# EAGLE board A13-SOM-LTE_Rev_B1 (EAGLE 4.16), part 1 of 2
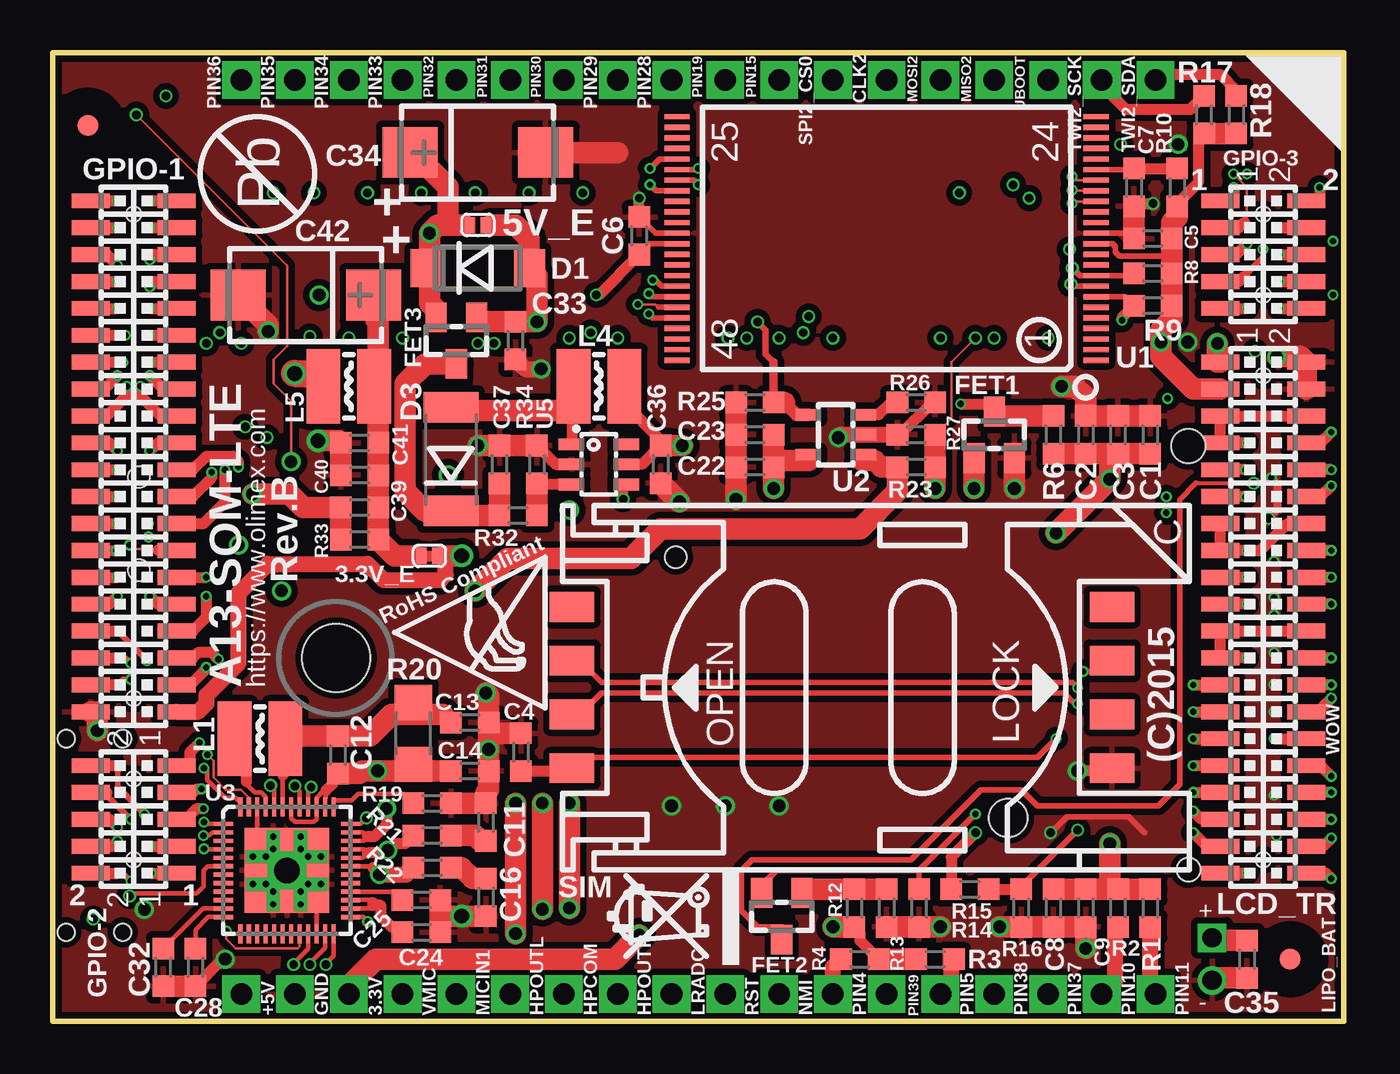
[diagram p2: board, top side]
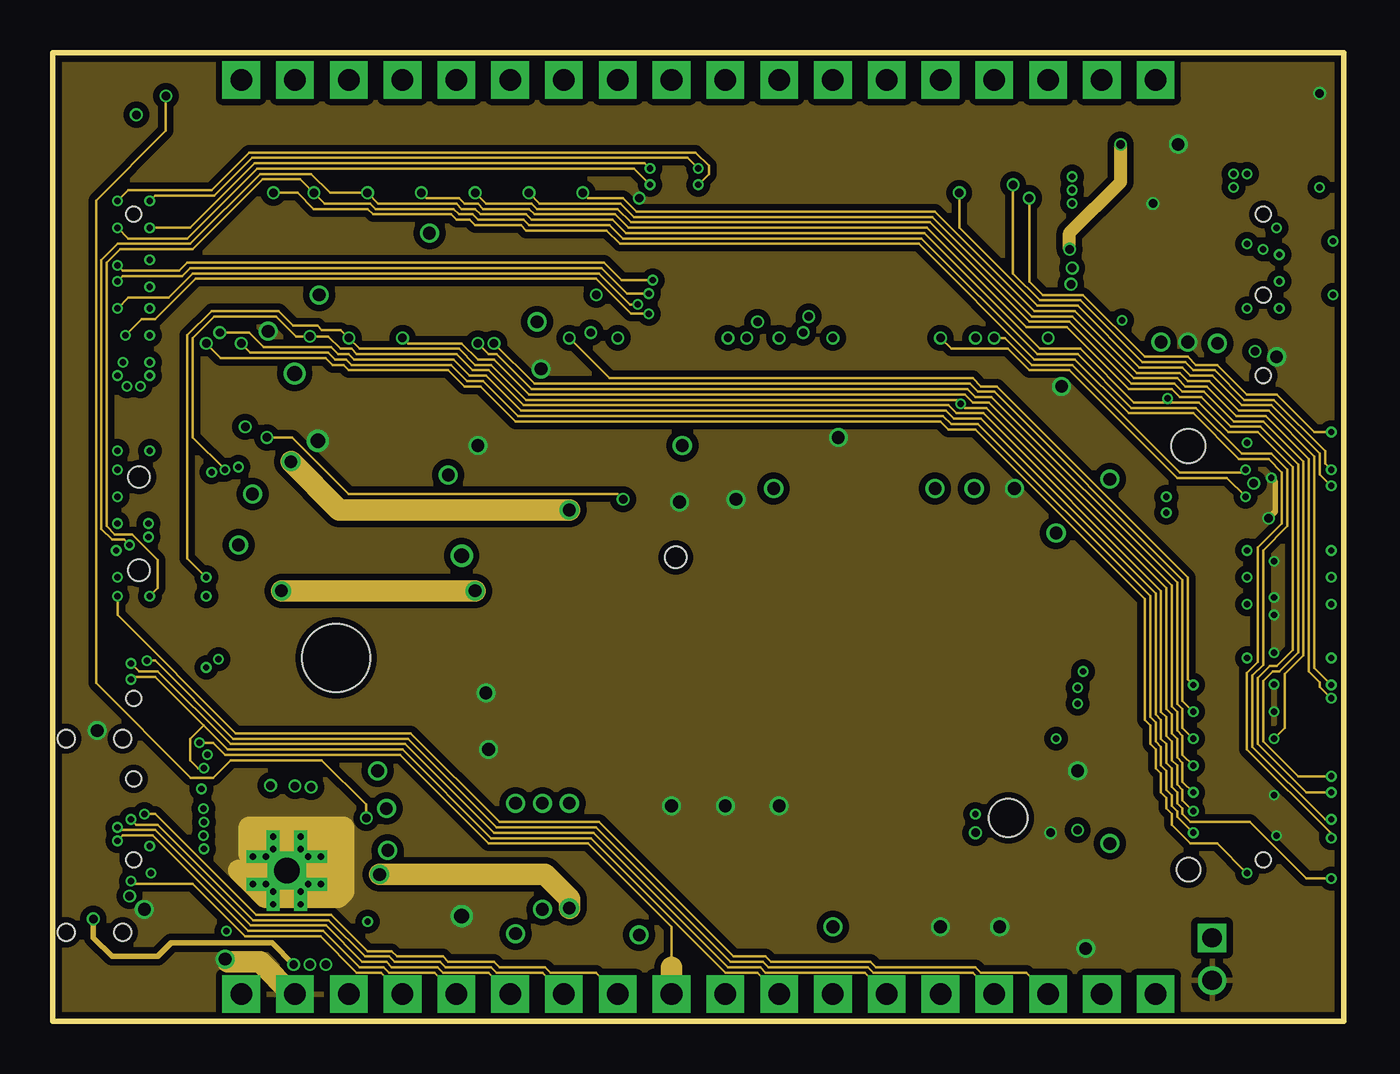
[diagram p3: board, inner layer Route2]
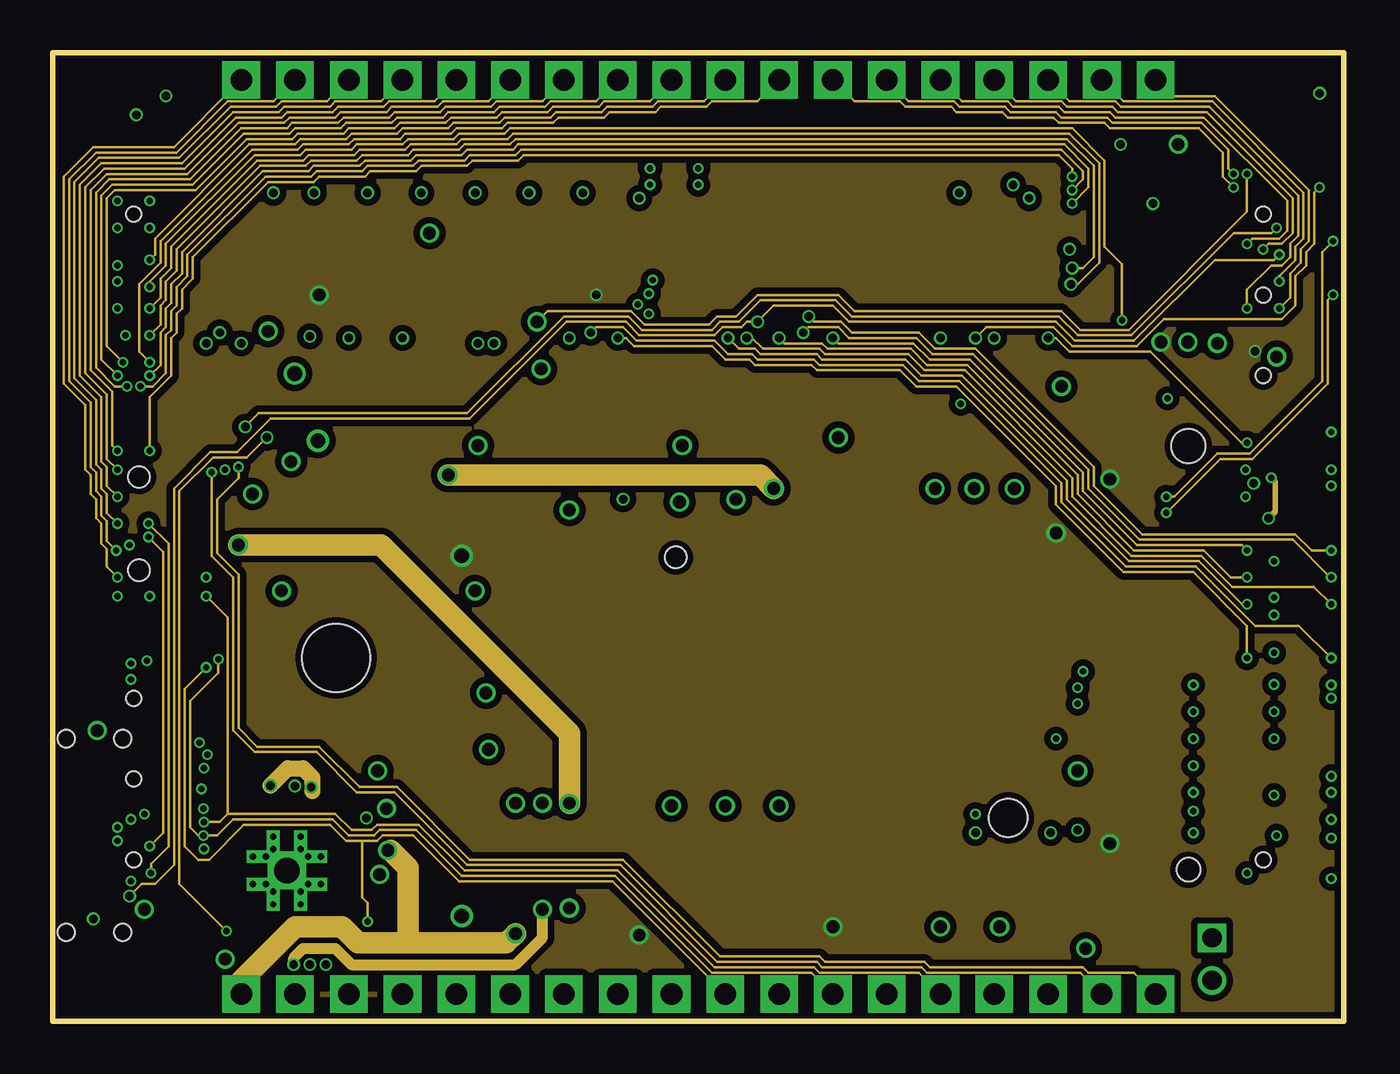
[diagram p4: board, inner layer Route15]
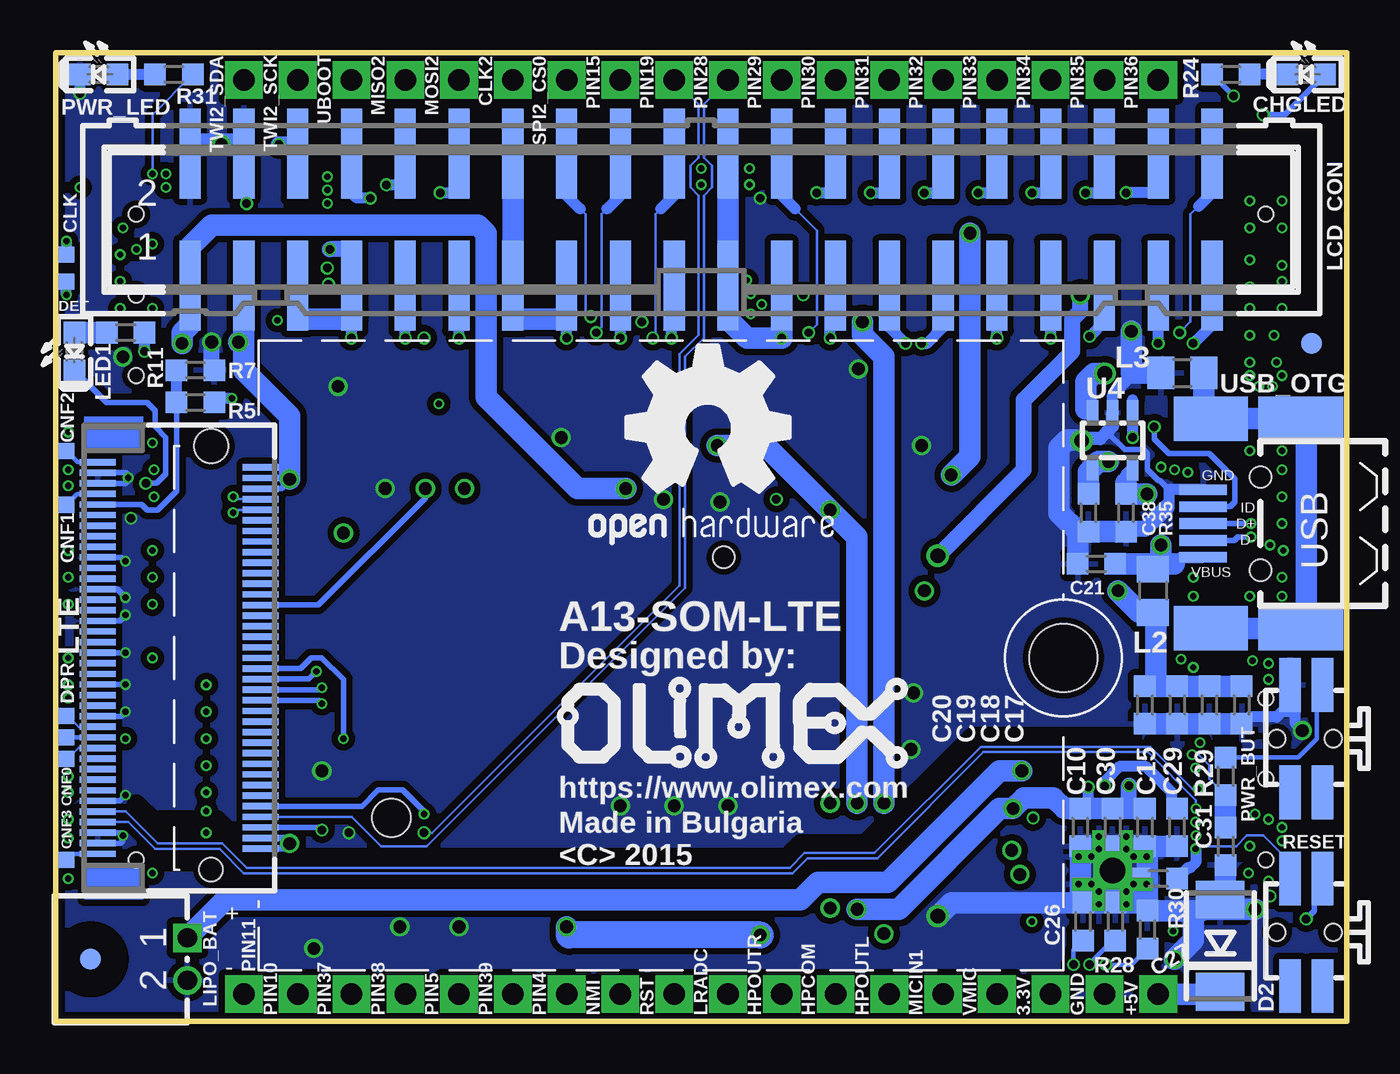
[diagram p5: board, bottom side, seen from below]

Size 60.96 x 45.72 mm. Coordinates in mm from the lower left corner, seen from the top.
Outline: 0,45.72 0,0 60.96,0 60.96,45.72 0,45.72
Copper layers (1*2+15*16): Top 0.035mm / dielectric 0.127mm / Route2 0.035mm / dielectric 1.1mm / Route15 0.035mm / dielectric 0.127mm / Bottom 0.035mm
Design rules "default": minimum track width 4.5mil, minimum drill 10mil, track to track 5mil, track to pad 5mil, pad to pad 5mil, via to via 5mil, smd to smd 1mil, copper to edge 8.5mil, drill to drill 8mil, minimum pad ring 6mil, minimum via ring 4mil, stop-mask expansion 4mil, vias tented up to drill 30mil, thermal gap 12mil
bRestrict: 10 lines

## Footprints (pad centres in the part's own frame; a part is rotated, then mirrored left to right if it is on the bottom)
TEST_PAD40/70/SQUARE = drill 1.016 pad 1.778 square: P$1 0,0
SJ_1_SMALLER_CLOSE = smd 0.508 x 0.762: 1 -0.381,0; 2 0.381,0
SJ_1_SMALLER = smd 0.508 x 0.762: 1 -0.381,0; 2 0.381,0
C0603_DWS = smd 1.016 x 1.016: 1 -0.889,0; 2 0.889,0
CT7343 = smd 2.6 x 2.4: + 3.2,0; - -3.2,0
LED-0603 = smd 1.016 x 1.016: A 0.889,0; C -0.889,0
TESTPAD_30-SQUARE = smd 0.762 x 0.762: 1 0,0
MLL-41 = smd 1.45 x 1.8: A 2.445,0; K -2.445,0
DO214AA = smd 1.778 x 2.286: A 2.177,0; C -2.177,0
MELF-MLL41 = smd 1.45 x 2.6: 1 -2.445,0; 2 2.445,0
SOT23 = smd 1.4 x 1: 1 1.1,-0.95; 2 1.1,0.95; 3 -1.1,0
FIDUCIAL-1X3 = smd 1 x 1: 1 0,0
GPH127SMT-02X20(PA-V16X-2X20-LF) = smd 0.7 x 1.8: 1 -12.065,-2.032; 2 -12.065,2.032; 3 -10.795,-2.032; 4 -10.795,2.032; 5 -9.525,-2.032; 6 -9.525,2.032; 7 -8.255,-2.032; 8 -8.255,2.032; 9 -6.985,-2.032; 10 -6.985,2.032; 11 -5.715,-2.032; 12 -5.715,2.032; 13 -4.445,-2.032; 14 -4.445,2.032; 15 -3.175,-2.032; 16 -3.175,2.032; 17 -1.905,-2.032; 18 -1.905,2.032; 19 -0.635,-2.032; 20 -0.635,2.032; 21 0.635,-2.032; 22 0.635,2.032; 23 1.905,-2.032; 24 1.905,2.032; 25 3.175,-2.032; 26 3.175,2.032; 27 4.445,-2.032; 28 4.445,2.032; 29 5.715,-2.032; 30 5.715,2.032; 31 6.985,-2.032; 32 6.985,2.032; 33 8.255,-2.032; 34 8.255,2.032; 35 9.525,-2.032; 36 9.525,2.032; 37 10.795,-2.032; 38 10.795,2.032; 39 12.065,-2.032; 40 12.065,2.032 | hole 0.7: -11.43,0; 11.43,0
GPH127SMT-02X05(PA-V16X-2X5-LF) = smd 0.7 x 1.8: 1 -2.54,-2.032; 2 -2.54,2.032; 3 -1.27,-2.032; 4 -1.27,2.032; 5 0,-2.032; 6 0,2.032; 7 1.27,-2.032; 8 1.27,2.032; 9 2.54,-2.032; 10 2.54,2.032 | hole 0.7: -1.905,0; 1.905,0
CD32 = smd 1.6 x 3.5: 1 -1.2,0; 2 1.2,0
L0805_5MIL_DWS = smd 1.27 x 1.524: 1 -1.016,0; 2 1.016,0
ML40-MALE(GBH-254-SMT-40) = smd 1 x 4.25: 1 -24.13,-3.125; 2 -24.13,3.125; 3 -21.59,-3.125; 4 -21.59,3.125; 5 -19.05,-3.125; 6 -19.05,3.125; 7 -16.51,-3.125; 8 -16.51,3.125; 9 -13.97,-3.125; 10 -13.97,3.125; 11 -11.43,-3.125; 12 -11.43,3.125; 13 -8.89,-3.125; 14 -8.89,3.125; 15 -6.35,-3.125; 16 -6.35,3.125; 17 -3.81,-3.125; 18 -3.81,3.125; 19 -1.27,-3.125; 20 -1.27,3.125; 21 1.27,-3.125; 22 1.27,3.125; 23 3.81,-3.125; 24 3.81,3.125; 25 6.35,-3.125; 26 6.35,3.125; 27 8.89,-3.125; 28 8.89,3.125; 29 11.43,-3.125; 30 11.43,3.125; 31 13.97,-3.125; 32 13.97,3.125; 33 16.51,-3.125; 34 16.51,3.125; 35 19.05,-3.125; 36 19.05,3.125; 37 21.59,-3.125; 38 21.59,3.125; 39 24.13,-3.125; 40 24.13,3.125
DW02R = drill 0.9 square: 1 -1,0 | drill 0.9 round: 2 1,0
M_2(NGFF) = smd 0.3 x 1.7: 1 -9.25,3.85; 2 -9,-3.85; 3 -8.75,3.85; 4 -8.5,-3.85; 5 -8.25,3.85; 6 -8,-3.85; 7 -7.75,3.85; 8 -7.5,-3.85; 9 -7.25,3.85; 10 -7,-3.85; 11 -6.75,3.85; 12 -6.5,-3.85; 13 -6.25,3.85; 14 -6,-3.85; 15 -5.75,3.85; 16 -5.5,-3.85; 17 -5.25,3.85; 18 -5,-3.85; 19 -4.75,3.85; 20 -4.5,-3.85; 21 -4.25,3.85; 22 -4,-3.85; 23 -3.75,3.85; 24 -3.5,-3.85; 25 -3.25,3.85; 26 -3,-3.85; 27 -2.75,3.85; 28 -2.5,-3.85; 29 -2.25,3.85; 30 -2,-3.85; 31 -1.75,3.85; 32 -1.5,-3.85; 33 -1.25,3.85; 34 -1,-3.85; 35 -0.75,3.85; 36 -0.5,-3.85; 37 -0.25,3.85; 38 0,-3.85; 39 0.25,3.85; 40 0.5,-3.85; 41 0.75,3.85; 42 1,-3.85; 43 1.25,3.85; 44 1.5,-3.85; 45 1.75,3.85; 46 2,-3.85; 47 2.25,3.85; 48 2.5,-3.85; 49 2.75,3.85; 50 3,-3.85; 51 3.25,3.85; 52 3.5,-3.85; 53 3.75,3.85; 54 4,-3.85; 55 4.25,3.85; 56 4.5,-3.85; 57 4.75,3.85; 58 5,-3.85; 59 5.25,3.85; 60 5.5,-3.85; 61 5.75,3.85; 62 6,-3.85; 63 6.25,3.85; 64 6.5,-3.85; 65 6.75,3.85; 66 7,-3.85; 67 7.25,3.85; 68 7.5,-3.85; 69 7.75,3.85; 70 8,-3.85; 71 8.25,3.85; 72 8.5,-3.85; 73 8.75,3.85; 74 9,-3.85; 75 9.25,3.85 | hole 1.1: -10,-1.5 | hole 1.6: 10,-1.5 | hole 3.2: 0,-41.75
SW_TAKT3X4 = smd 2.54 x 1.016: 1_1 -2.54,0.762; 1_2 2.54,0.762; 2_1 -2.54,-0.762; 2_2 2.54,-0.762 | hole 0.8: 0,-1.397; 0,1.27
R0603_5MIL_DWS = smd 1.016 x 1.016: 1 -0.889,0; 2 0.889,0
R1206_5MIL_WS = smd 1.651 x 1.778: 1 -1.46,0; 2 1.46,0
SIM-CARD-8PIN-TRUE-PIN-NUMBERING = smd 2.1 x 1.4: 1 14.35,3.81; 2 14.35,1.27; 3 14.35,-1.27; 4 14.35,-3.81; 5 -11.15,3.81; 6 -11.15,1.27; 7 -11.15,-1.27; 8 -11.15,-3.81 | hole 1: 9.45,-6.15 | hole 1.8: -6.25,6.15
TSOP48 = smd 1.2 x 0.25: 1 -9.9,5.75; 2 -9.9,5.25; 3 -9.9,4.75; 4 -9.9,4.25; 5 -9.9,3.75; 6 -9.9,3.25; 7 -9.9,2.75; 8 -9.9,2.25; 9 -9.9,1.75; 10 -9.9,1.25; 11 -9.9,0.75; 12 -9.9,0.25; 13 -9.9,-0.25; 14 -9.9,-0.75; 15 -9.9,-1.25; 16 -9.9,-1.75; 17 -9.9,-2.25; 18 -9.9,-2.75; 19 -9.9,-3.25; 20 -9.9,-3.75; 21 -9.9,-4.25; 22 -9.9,-4.75; 23 -9.9,-5.25; 24 -9.9,-5.75; 25 9.9,-5.75; 26 9.9,-5.25; 27 9.9,-4.75; 28 9.9,-4.25; 29 9.9,-3.75; 30 9.9,-3.25; 31 9.9,-2.75; 32 9.9,-2.25; 33 9.9,-1.75; 34 9.9,-1.25; 35 9.9,-0.75; 36 9.9,-0.25; 37 9.9,0.25; 38 9.9,0.75; 39 9.9,1.25; 40 9.9,1.75; 41 9.9,2.25; 42 9.9,2.75; 43 9.9,3.25; 44 9.9,3.75; 45 9.9,4.25; 46 9.9,4.75; 47 9.9,5.25; 48 9.9,5.75
SOT23-5 = smd 1.2 x 0.55: 1 1.3,-0.95; 2 1.3,0; 3 1.3,0.95; 4 -1.3,0.95; 5 -1.3,-0.95
QFN48 = smd 0.2 x 0.9: 1 -2.2,-3; 2 -1.8,-3; 3 -1.4,-3; 4 -1,-3; 5 -0.6,-3; 6 -0.2,-3; 7 0.2,-3; 8 0.6,-3; 9 1,-3; 10 1.4,-3; 11 1.8,-3; 12 2.2,-3; 25 2.2,3; 26 1.8,3; 27 1.4,3; 28 1,3; 29 0.6,3; 30 0.2,3; 31 -0.2,3; 32 -0.6,3; 33 -1,3; 34 -1.4,3; 35 -1.8,3; 36 -2.2,3 | smd 0.9 x 0.2: 13 3,-2.2; 14 3,-1.8; 15 3,-1.4; 16 3,-1; 17 3,-0.6; 18 3,-0.2; 19 3,0.2; 20 3,0.6; 21 3,1; 22 3,1.4; 23 3,1.8; 24 3,2.2; 37 -3,2.2; 38 -3,1.8; 39 -3,1.4; 40 -3,1; 41 -3,0.6; 42 -3,0.2; 43 -3,-0.2; 44 -3,-0.6; 45 -3,-1; 46 -3,-1.4; 47 -3,-1.8; 48 -3,-2.2 | drill 1.2 pad 1.422 square: N1 0,0 | drill 0.3 pad 0.4 square: N2 -1.6,0.65; N3 -1,0.65; N4 -1.6,-0.65; N5 -1,-0.65; N6 -0.65,-1.6; N7 -0.65,-1; N8 0.65,-1.6; N9 0.65,-1; N10 1.6,-0.65; N11 1,-0.65; N12 1.6,0.65; N13 1,0.65; N14 0.65,1.6; N15 0.65,1; N16 -0.65,1.6; N17 -0.65,1 | smd 4 x 4: VSS 0,0
SOT23-6 = smd 1.2 x 0.55: 1 1.3,-0.95; 2 1.3,0; 3 1.3,0.95; 4 -1.3,0.95; 5 -1.3,0; 6 -1.3,-0.95
USB_MINI_9PIN = smd 2.25 x 0.5: D+ 2.706,0; D- 2.706,0.8; GND 2.706,-1.6; ID 2.706,-0.8; VBUS 2.706,1.6 | smd 4 x 2.1: GND1 -1.9,4.95; GND3 -1.9,-4.95 | smd 3.5 x 2.1: GND2 2.35,4.95; GND4 2.35,-4.95 | hole 1: 0,2.2; 0,-2.2

## Placement (x,y rotation side)
3.3V  TESTPAD3  [TEST_PAD40/70/SQUARE]  13.97,1.27 0 top
3.3V_E  Close  [SJ_1_SMALLER_CLOSE]  17.78,21.97 0 top
5V_E  Open  [SJ_1_SMALLER]  20.07,37.59 180 top
+5V  TESTPAD3  [TEST_PAD40/70/SQUARE]  8.89,1.27 0 top
C1  22uF/6.3V  [C0603_DWS]  51.82,27.69 90 top
C2  100nF  [C0603_DWS]  48.77,27.69 270 top
C3  100nF  [C0603_DWS]  50.29,27.69 270 top
C4  100nF  [C0603_DWS]  22.1,12.7 90 top
C5  NA(22uF/6.3V)  [C0603_DWS]  51.94,36.96 0 top
C6  NA(100nF)  [C0603_DWS]  27.69,37.08 270 top
C7  NA(100nF)  [C0603_DWS]  51.05,39.37 90 top
C8  22uF/6.3V  [C0603_DWS]  47.24,5.33 270 top
C9  100nF  [C0603_DWS]  48.77,5.33 90 top
C10  10uF/6.3V  [C0603_DWS]  12.57,9.14 90 bottom
C11  10uF/6.3V  [C0603_DWS]  20.45,9.4 270 top
C12  1uF  [C0603_DWS]  13.46,12.57 270 top
C13  10uF/6.3V  [C0603_DWS]  19.68,14.1 0 top
C14  10uF/6.3V  [C0603_DWS]  19.68,11.81 0 top
C15  10uF/6.3V  [C0603_DWS]  9.53,9.14 270 bottom
C16  10uF/6.3V  [C0603_DWS]  20.45,5.84 90 top
C17  22uF/6.3V  [C0603_DWS]  4.95,14.92 270 bottom
C18  22uF/6.3V  [C0603_DWS]  6.48,14.92 270 bottom
C19  22uF/6.3V  [C0603_DWS]  8,14.92 270 bottom
C20  22uF/6.3V  [C0603_DWS]  9.53,14.92 270 bottom
C21  100nF  [C0603_DWS]  11.81,21.59 180 bottom
C22  22uF/6.3V  [C0603_DWS]  33.15,26.16 180 top
C23  100nF  [C0603_DWS]  33.15,27.69 180 top
C24  1uF  [C0603_DWS]  17.4,4.19 180 top
C25  NA(10uF/6.3V)  [C0603_DWS]  17.4,5.71 0 top
C26  1uF  [C0603_DWS]  12.45,4.7 270 bottom
C27  10uF/6.3V  [C0603_DWS]  9.4,4.32 270 bottom
C28  NA(10uF/6.3V)  [C0603_DWS]  6.73,2.54 270 top
C29  NA(10uF/6.3V)  [C0603_DWS]  8.01,9.14 270 bottom
C30  10uF/6.3V  [C0603_DWS]  11.05,9.14 270 bottom
C31  1nF  [C0603_DWS]  5.71,8.26 90 bottom
C32  NA(10uF/6.3V)  [C0603_DWS]  5.21,2.54 270 top
C33  22uF/6.3V  [C0603_DWS]  21.84,32.13 270 top
C34  NA  [CT7343]  20.07,41.02 180 top
C35  22uF/6.3V  [C0603_DWS]  56.39,2.92 90 top
C36  22uF/6.3V  [C0603_DWS]  28.7,26.29 90 top
C37  22uF/6.3V  [C0603_DWS]  21.08,26.29 90 top
C38  22uF/6.3V  [C0603_DWS]  12.19,24 270 bottom
C39  47pF  [C0603_DWS]  14.48,24.26 180 top
C40  22uF/6.3V  [C0603_DWS]  14.48,25.78 180 top
C41  22uF/6.3V  [C0603_DWS]  14.48,27.3 180 top
C42  220uF/10V/tant  [CT7343]  11.94,34.29 0 top
CHGLED  LED/YELLOW/0603  [LED-0603]  1.91,44.7 0 bottom
CLK  TESTPAD30/30/SQUARE  [TESTPAD_30-SQUARE]  60.45,36.2 0 bottom
CLK2  TESTPAD3  [TEST_PAD40/70/SQUARE]  39.37,44.45 90 top
CNF0  TESTPAD30/30/SQUARE  [TESTPAD_30-SQUARE]  60.45,12.38 180 bottom
CNF1  TESTPAD30/30/SQUARE  [TESTPAD_30-SQUARE]  60.45,24.38 0 bottom
CNF2  TESTPAD30/30/SQUARE  [TESTPAD_30-SQUARE]  60.45,26.92 0 bottom
CNF3  TESTPAD30/30/SQUARE  [TESTPAD_30-SQUARE]  60.45,7.62 180 bottom
D1  1N5822/SS34/SMA  [MLL-41]  20.07,35.56 0 top
D2  SMBJ6.0A  [DO214AA]  5.97,3.56 90 bottom
D3  1N5822/SS34/SMA  [MELF-MLL41]  18.8,26.54 90 top
DET  TESTPAD30/30/SQUARE  [TESTPAD_30-SQUARE]  60.45,34.92 0 bottom
DPR  TESTPAD30/30/SQUARE  [TESTPAD_30-SQUARE]  60.45,14.41 180 bottom
FET1  BSS138(SOT23-3)  [SOT23]  44.45,27.69 270 top
FET2  BSS138(SOT23-3)  [SOT23]  34.42,4.95 90 top
FET3  IRLML6402  [SOT23]  19.05,32.13 90 top
FID1  FIDUCIAL  [FIDUCIAL-1X3]  59.31,2.92 180 bottom
FID2  FIDUCIAL  [FIDUCIAL-1X3]  1.65,32 0 bottom
FID3  FIDUCIAL  [FIDUCIAL-1X3]  58.42,2.92 180 top
FID4  FIDUCIAL  [FIDUCIAL-1X3]  1.65,42.29 180 top
GND  TESTPAD3  [TEST_PAD40/70/SQUARE]  11.43,1.27 0 top
GPIO-1  GPH127SMT-02X20(PA-V16X-2X20-LF)  [GPH127SMT-02X20(PA-V16X-2X20-LF)]  3.81,26.67 90 top
GPIO-2  GPH127SMT-02X05(PA-V16X-2X5-LF)  [GPH127SMT-02X05(PA-V16X-2X5-LF)]  3.81,9.53 90 top
GPIO-3  GPH127SMT-02X05(PA-V16X-2X5-LF)  [GPH127SMT-02X05(PA-V16X-2X5-LF)]  57.15,36.2 270 top
HPCOM  TESTPAD3  [TEST_PAD40/70/SQUARE]  24.13,1.27 270 top
HPOUTL  TESTPAD3  [TEST_PAD40/70/SQUARE]  21.59,1.27 270 top
HPOUTR  TESTPAD3  [TEST_PAD40/70/SQUARE]  26.67,1.27 270 top
L1  2.2uH/1.5A/DCR<0.1R/CD32  [CD32]  9.78,13.34 0 top
L2  FB0805/600R/2A  [L0805_5MIL_DWS]  9.14,20.32 270 bottom
L3  FB0805/600R/200mA(201209-601)  [L0805_5MIL_DWS]  7.75,30.61 0 bottom
L4  2.2uH/1.5A/DCR<0.1R/CD32  [CD32]  25.78,29.97 180 top
L5  2.2uH/1.5A/DCR<0.1R/CD32  [CD32]  13.97,29.97 0 top
LCD_CON  NA(GBH-254-SMT-40)  [ML40-MALE(GBH-254-SMT-40)]  30.48,37.85 0 bottom
LCD_TR  GPH127SMT-02X20(PA-V16X-2X20-LF)  [GPH127SMT-02X20(PA-V16X-2X20-LF)]  57.15,19.05 270 top
LED1  LED/GREEN/0603  [LED-0603]  60.07,31.62 90 bottom
LIPO_BAT  DW02R  [DW02R]  54.74,2.92 270 bottom
LRADC  TESTPAD3  [TEST_PAD40/70/SQUARE]  29.21,1.27 270 top
LTE  VZ20M11QTZ+2199119-3  [M_2(NGFF)]  55.12,17.14 90 bottom
MICIN1  TESTPAD3  [TEST_PAD40/70/SQUARE]  19.05,1.27 270 top
MISO2  TESTPAD3  [TEST_PAD40/70/SQUARE]  44.45,44.45 90 top
MOSI2  TESTPAD3  [TEST_PAD40/70/SQUARE]  41.91,44.45 90 top
NMI  TESTPAD3  [TEST_PAD40/70/SQUARE]  34.29,1.27 270 top
PIN4  TESTPAD3  [TEST_PAD40/70/SQUARE]  36.83,1.27 90 top
PIN5  TESTPAD3  [TEST_PAD40/70/SQUARE]  41.91,1.27 90 top
PIN10  TESTPAD3  [TEST_PAD40/70/SQUARE]  49.53,1.27 90 top
PIN11  TESTPAD3  [TEST_PAD40/70/SQUARE]  52.07,1.27 90 top
PIN15  TESTPAD3  [TEST_PAD40/70/SQUARE]  34.29,44.45 90 top
PIN19  TESTPAD3  [TEST_PAD40/70/SQUARE]  31.75,44.45 0 top
PIN28  TESTPAD3  [TEST_PAD40/70/SQUARE]  29.21,44.45 270 top
PIN29  TESTPAD3  [TEST_PAD40/70/SQUARE]  26.67,44.45 270 top
PIN30  TESTPAD3  [TEST_PAD40/70/SQUARE]  24.13,44.45 270 top
PIN31  TESTPAD3  [TEST_PAD40/70/SQUARE]  21.59,44.45 270 top
PIN32  TESTPAD3  [TEST_PAD40/70/SQUARE]  19.05,44.45 270 top
PIN33  TESTPAD3  [TEST_PAD40/70/SQUARE]  16.51,44.45 270 top
PIN34  TESTPAD3  [TEST_PAD40/70/SQUARE]  13.97,44.45 270 top
PIN35  TESTPAD3  [TEST_PAD40/70/SQUARE]  11.43,44.45 270 top
PIN36  TESTPAD3  [TEST_PAD40/70/SQUARE]  8.89,44.45 270 top
PIN37  TESTPAD3  [TEST_PAD40/70/SQUARE]  46.99,1.27 270 top
PIN38  TESTPAD3  [TEST_PAD40/70/SQUARE]  44.45,1.27 270 top
PIN39  TESTPAD3  [TEST_PAD40/70/SQUARE]  39.37,1.27 270 top
PWR_BUT  SW-TAKTSIDE_WTCM-TR(3X4)  [SW_TAKT3X4]  1.91,13.34 270 bottom
PWR_LED  LED/RED/0603  [LED-0603]  58.93,44.7 0 bottom
R1  2.2k  [R0603_5MIL_DWS]  51.82,5.33 90 top
R2  2.2k  [R0603_5MIL_DWS]  50.29,5.33 90 top
R3  2.2k  [R0603_5MIL_DWS]  41.66,2.92 180 top
R4  2.2k  [R0603_5MIL_DWS]  38.1,2.92 0 top
R5  2k  [R0603_5MIL_DWS]  54.36,29.21 180 bottom
R6  10k  [R0603_5MIL_DWS]  47.24,27.69 90 top
R7  2.2k  [R0603_5MIL_DWS]  54.36,30.73 0 bottom
R8  NA(10k)  [R0603_5MIL_DWS]  51.94,35.31 180 top
R9  NA(10k)  [R0603_5MIL_DWS]  51.94,33.78 180 top
R10  NA(10k)  [R0603_5MIL_DWS]  53.09,39.37 90 top
R11  1k  [R0603_5MIL_DWS]  57.66,32.51 180 bottom
R12  2k  [R0603_5MIL_DWS]  37.85,5.33 90 top
R13  2.2k  [R0603_5MIL_DWS]  39.37,5.33 270 top
R14  2k  [R0603_5MIL_DWS]  40.89,5.33 270 top
R15  2k  [R0603_5MIL_DWS]  43.31,6.22 180 top
R16  2.2k  [R0603_5MIL_DWS]  45.72,5.33 270 top
R17  2.2k  [R0603_5MIL_DWS]  54.36,42.8 270 top
R18  2.2k  [R0603_5MIL_DWS]  55.88,42.8 270 top
R19  240R/1%  [R0603_5MIL_DWS]  17.91,10.29 180 top
R20  0.03R/1%  [R1206_5MIL_WS]  17.02,13.59 270 top
R21  1R  [R0603_5MIL_DWS]  17.91,8.76 180 top
R22  1R  [R0603_5MIL_DWS]  17.91,7.24 180 top
R23  47k  [R0603_5MIL_DWS]  40.77,26.16 180 top
R24  2.2k  [R0603_5MIL_DWS]  5.46,44.7 180 bottom
R25  200k/1%  [R0603_5MIL_DWS]  33.15,29.21 0 top
R26  13k/1%  [R0603_5MIL_DWS]  40.77,29.21 180 top
R27  100k/1%  [R0603_5MIL_DWS]  40.77,27.69 0 top
R28  200k/1%  [R0603_5MIL_DWS]  10.92,4.7 270 bottom
R29  2.2k  [R0603_5MIL_DWS]  5.71,11.56 270 bottom
R30  2.2k  [R0603_5MIL_DWS]  8.89,6.73 0 bottom
R31  2.2k  [R0603_5MIL_DWS]  55.37,44.7 180 bottom
R32  8.2k/1%  [R0603_5MIL_DWS]  21.97,23.88 180 top
R33  4.99k/1%  [R0603_5MIL_DWS]  14.48,22.73 180 top
R34  1.1k/1%  [R0603_5MIL_DWS]  22.86,26.29 90 top
R35  1.1k/1%  [R0603_5MIL_DWS]  10.41,24 270 bottom
RESET  SW-TAKTSIDE_WTCM-TR(3X4)  [SW_TAKT3X4]  1.91,4.19 270 bottom
RST  TESTPAD3  [TEST_PAD40/70/SQUARE]  31.75,1.27 90 top
SIM  SIM-HOLDER-8PINS  [SIM-CARD-8PIN-TRUE-PIN-NUMBERING]  38.86,15.75 180 top
SPI2_CS0  TESTPAD3  [TEST_PAD40/70/SQUARE]  36.83,44.45 90 top
TWI2_SCK  TESTPAD3  [TEST_PAD40/70/SQUARE]  49.53,44.45 90 top
TWI2_SDA  TESTPAD3  [TEST_PAD40/70/SQUARE]  52.07,44.45 90 top
U1  NA(H27UBG8T2BTR)  [TSOP48]  39.37,36.96 180 top
U2  SY6280  [SOT23-5]  36.96,27.69 0 top
U3  AXP209(QFN48)  [QFN48]  11.05,7.11 270 top
U4  SY8009AAAC(SOT23-5)  [SOT23-5]  11.05,27.43 90 bottom
U5  SY7208(SOT23-6)  [SOT23-6]  25.78,26.29 180 top
U$5  [LOGO-OPENHARDWARE_8X8]  30.16,27.94 0 bottom
U$8  [OLIMEX1_V]  19.56,11.81 0 bottom
U$9  [PB]  9.65,40.01 90 top
U$10  [ESD_SYMBOL]  23.24,14.8 90 top
U$11  [RECYCLE_BIN1/8]  32.38,2.67 90 top
UBOOT  TESTPAD3  [TEST_PAD40/70/SQUARE]  46.99,44.45 90 top
USB_OTG  USB-OTG  [USB_MINI_9PIN]  4.06,23.5 180 bottom
VMIC  TESTPAD3  [TEST_PAD40/70/SQUARE]  16.51,1.27 270 top
WOW  TESTPAD30/30/SQUARE  [TESTPAD_30-SQUARE]  60.45,13.4 180 bottom